# EAGLE board AMR3350 (EAGLE 9.4.1), part 1 of 2
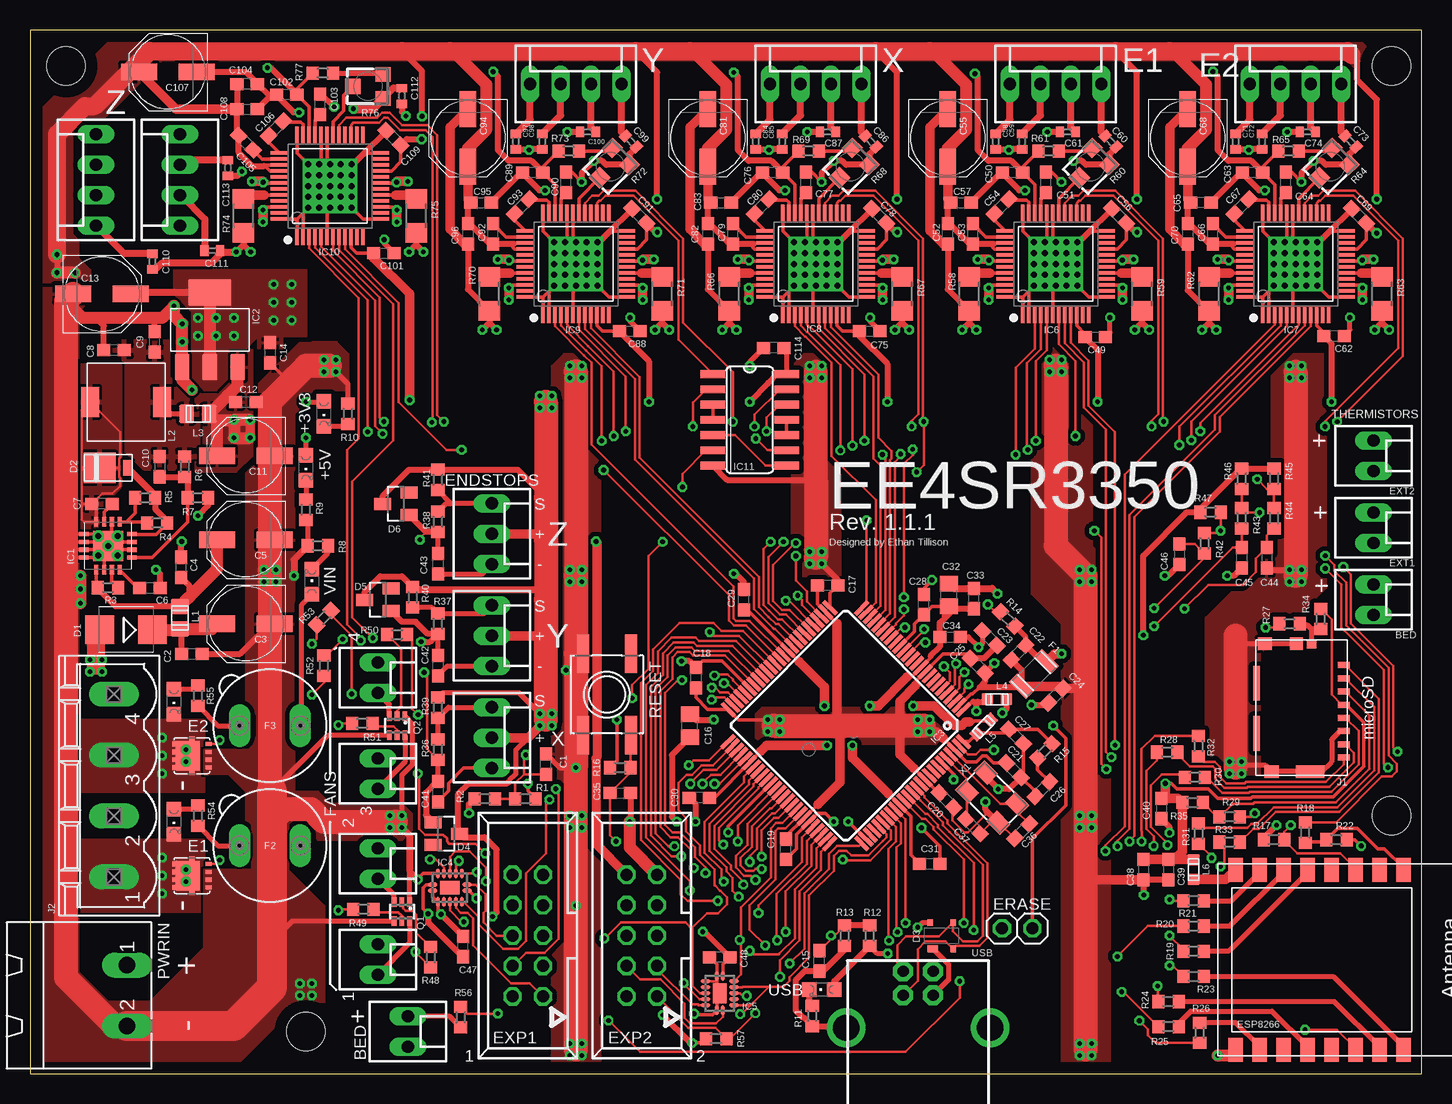
[diagram p7: board, top side]
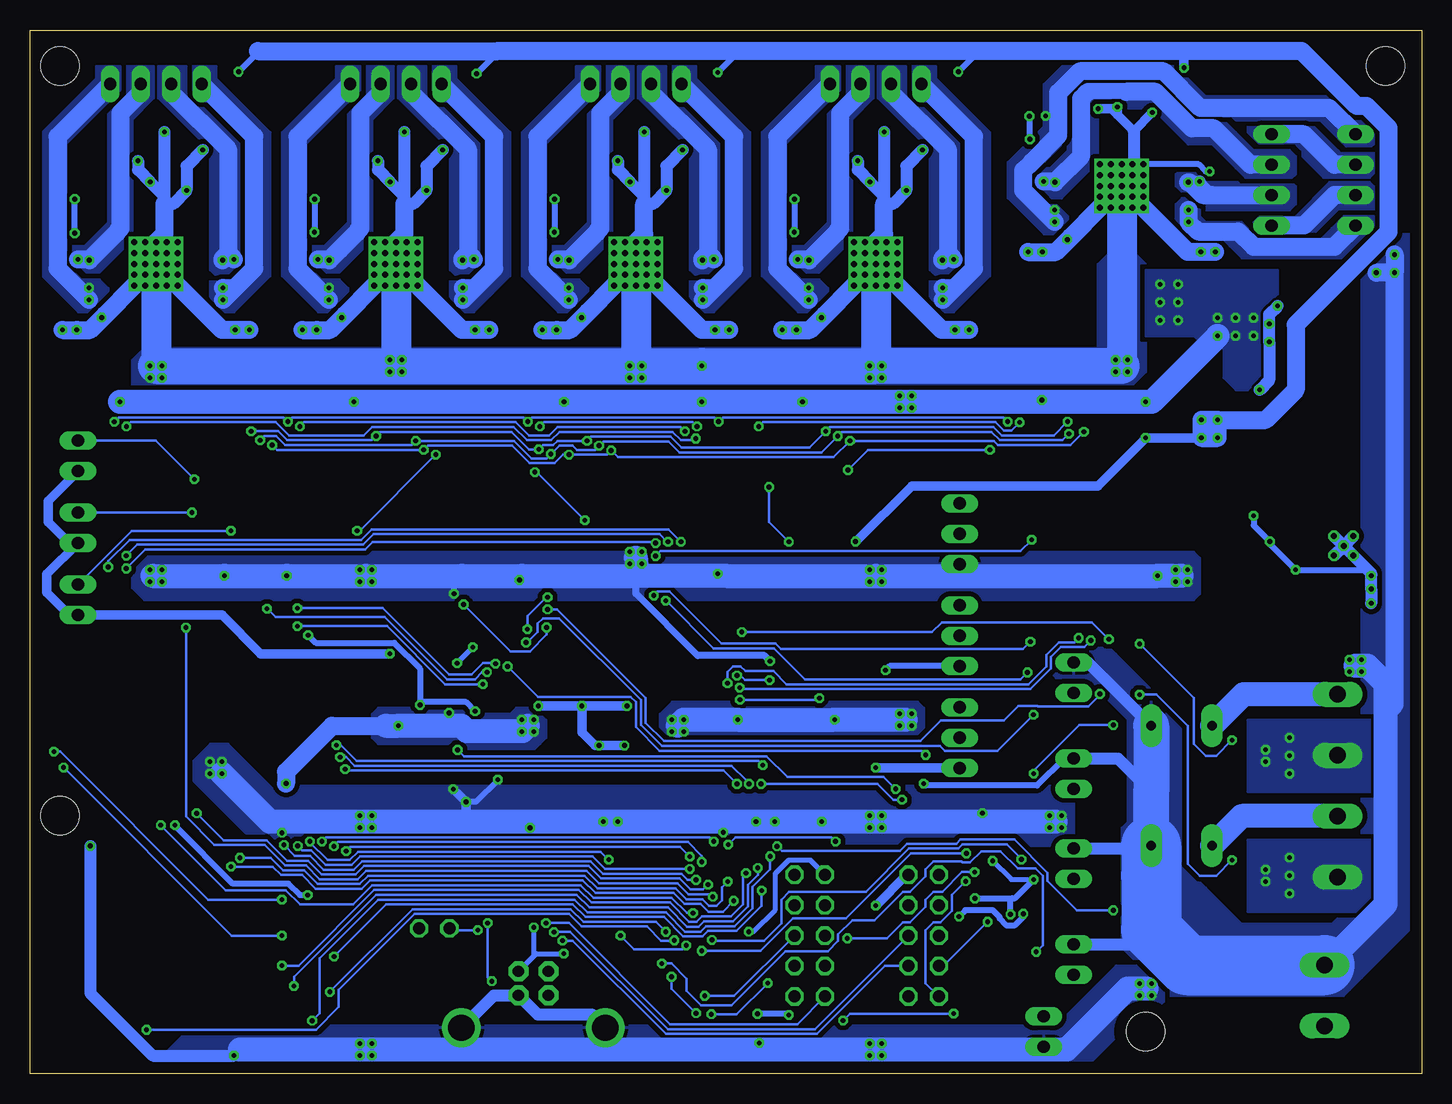
[diagram p8: board, bottom side, seen from below]

Size 116 x 87 mm. Coordinates in mm from the lower left corner, seen from the top.
Outline: 0,0 116,0 116,87 0,87 0,0
Copper layers (1*16): Top 0.035mm / dielectric 1.5mm / Bottom 0.035mm
Design rules "default *": minimum track width 0.2mm, minimum drill 0.4mm, track to track 0.2mm, track to pad 0.25mm, pad to pad 0.2mm, via to via 0.2mm, smd to smd 0.2mm, copper to edge 1mm, drill to drill 0.2mm, minimum pad ring 10mil, minimum via ring 8mil, stop-mask expansion 0mil, vias tented up to drill 16.5mil, thermal gap 10mil
Net classes: 3 usbvcc: width 0.102 mm, drill 0.1 mm, clearance 0.15 mm; 4 diff: width 0.2 mm
Holes 3.2 mm at 23,3.5 3,84 113.5,84 113.5,21.5
tKeepout: area 20,0.5 to 26,6.5; area 0,81 to 6,87; area 110.5,81 to 116.5,87; area 110.5,18.5 to 116.5,24.5

## Footprints (pad centres in the part's own frame; a part is rotated, then mirrored left to right if it is on the bottom)
CHIPLED_0805 = smd 1.2 x 1.2: A 0,-1.05; C 0,1.05
MOLEX-KK-254-2 = drill 1.02 long: 1 -1.27,0; 2 1.27,0
C0603 = smd 1.1 x 1: 1 -0.85,0; 2 0.85,0
PANASONIC_D = smd 3 x 1.4: + 2.4,0; - -2.4,0
C0805 = smd 1.3 x 1.5: 1 -0.95,0; 2 0.95,0
C0402 = smd 0.7 x 0.9: 1 -0.65,0; 2 0.65,0
SMB = smd 2.4 x 2.4: A 2.2,0; C -2.2,0
DO220AAL = smd 2.667 x 2.54: P$1 -0.7,0 | smd 0.762 x 1.27: P$2 1.65,0
SOT143B = smd 0.88 x 0.55: 1 -0.75,-1.1 | smd 0.48 x 0.55: 2 0.95,-1.1; 3 0.95,1.1; 4 -0.95,1.1
SOT23 = smd 1 x 1.4: 1 -0.95,-1.1; 2 0.95,-1.1; 3 0,1.1
1X02 = drill 1.016 octagon: 1 -1.27,0; 2 1.27,0
ESP-12 = smd 2 x 1.2: 1 -7.5,4.5; 2 -7.5,2.5; 3 -7.5,0.5; 4 -7.5,-1.5; 5 -7.5,-3.5; 6 -7.5,-5.5; 7 -7.5,-7.5; 8 -7.5,-9.5; 9 7.5,-9.5; 10 7.5,-7.5; 11 7.5,-5.5; 12 7.5,-3.5; 13 7.5,-1.5; 14 7.5,0.5; 15 7.5,2.5; 16 7.5,4.5
057-010-1 = drill 1 octagon: 1 -5.08,-1.27; 2 -5.08,1.27; 3 -2.54,-1.27; 4 -2.54,1.27; 5 0,-1.27; 6 0,1.27; 7 2.54,-1.27; 8 2.54,1.27; 9 5.08,-1.27; 10 5.08,1.27
MC36207 = smd 1 x 2: 1 -1.45,0; 2 1.45,0
19560 = drill 0.813 pad 1.778 long: 1 -2.54,0; 2 2.54,0
QFN16-4X4 = smd 0.8 x 0.35: 1 -2,0.975; 2 -2,0.325; 3 -2,-0.325; 4 -2,-0.975; 9 2,-0.975; 10 2,-0.325; 11 2,0.325; 12 2,0.975 | smd 0.35 x 0.8: 5 -0.975,-2; 6 -0.325,-2; 7 0.325,-2; 8 0.975,-2; 13 0.975,2; 14 0.325,2; 15 -0.325,2; 16 -0.975,2 | smd 2.5 x 2.5: EXP 0,0
SOT223 = smd 2.235 x 1.219: 1 -3.099,2.311; 2 -3.099,0; 3 -3.099,-2.311 | smd 2.2 x 3.6: 4 3.099,0
LQFP100 = smd 1.5 x 0.35: 1 -7.875,6; 2 -7.875,5.5; 3 -7.875,5; 4 -7.875,4.5; 5 -7.875,4; 6 -7.875,3.5; 7 -7.875,3; 8 -7.875,2.5; 9 -7.875,2; 10 -7.875,1.5; 11 -7.875,1; 12 -7.875,0.5; 13 -7.875,0; 14 -7.875,-0.5; 15 -7.875,-1; 16 -7.875,-1.5; 17 -7.875,-2; 18 -7.875,-2.5; 19 -7.875,-3; 20 -7.875,-3.5; 21 -7.875,-4; 22 -7.875,-4.5; 23 -7.875,-5; 24 -7.875,-5.5; 25 -7.875,-6; 51 7.875,-6; 52 7.875,-5.5; 53 7.875,-5; 54 7.875,-4.5; 55 7.875,-4; 56 7.875,-3.5; 57 7.875,-3; 58 7.875,-2.5; 59 7.875,-2; 60 7.875,-1.5; 61 7.875,-1; 62 7.875,-0.5; 63 7.875,0; 64 7.875,0.5; 65 7.875,1; 66 7.875,1.5; 67 7.875,2; 68 7.875,2.5; 69 7.875,3; 70 7.875,3.5; 71 7.875,4; 72 7.875,4.5; 73 7.875,5; 74 7.875,5.5; 75 7.875,6 | smd 0.35 x 1.5: 26 -6.025,-7.875; 27 -5.525,-7.875; 28 -5.025,-7.875; 29 -4.525,-7.875; 30 -4.025,-7.875; 31 -3.525,-7.875; 32 -3.025,-7.875; 33 -2.525,-7.875; 34 -2.025,-7.875; 35 -1.525,-7.875; 36 -1.025,-7.875; 37 -0.525,-7.875; 38 -0.025,-7.875; 39 0.475,-7.875; 40 0.975,-7.875; 41 1.475,-7.875; 42 1.975,-7.875; 43 2.475,-7.875; 44 2.975,-7.875; 45 3.475,-7.875; 46 3.975,-7.875; 47 4.475,-7.875; 48 4.975,-7.875; 49 5.475,-7.875; 50 5.975,-7.875; 76 6,7.875; 77 5.5,7.875; 78 5,7.875; 79 4.5,7.875; 80 4,7.875; 81 3.5,7.875; 82 3,7.875; 83 2.5,7.875; 84 2,7.875; 85 1.5,7.875; 86 1,7.875; 87 0.5,7.875; 88 0,7.875; 89 -0.5,7.875; 90 -1,7.875; 91 -1.5,7.875; 92 -2,7.875; 93 -2.5,7.875; 94 -3,7.875; 95 -3.5,7.875; 96 -4,7.875; 97 -4.5,7.875; 98 -5,7.875; 99 -5.5,7.875; 100 -6,7.875
DHVQFN14 = smd 0.8 x 0.35: 1 -1.425,-0.25; 7 1.425,-0.25; 8 1.425,0.25; 14 -1.425,0.25 | smd 0.35 x 0.8: 2 -1,-1.175; 3 -0.5,-1.175; 4 0,-1.175; 5 0.5,-1.175; 6 1,-1.175; 9 1,1.175; 10 0.5,1.175; 11 0,1.175; 12 -0.5,1.175; 13 -1,1.175 | smd 1.65 x 1.15: EXP 0,0
QFP50P900X900X113-49N_NOFID = smd 1.45 x 0.3: 1 -4.2,2.75; 2 -4.2,2.25; 3 -4.2,1.75; 4 -4.2,1.25; 5 -4.2,0.75; 6 -4.2,0.25; 7 -4.2,-0.25; 8 -4.2,-0.75; 9 -4.2,-1.25; 10 -4.2,-1.75; 11 -4.2,-2.25; 12 -4.2,-2.75; 25 4.2,-2.75; 26 4.2,-2.25; 27 4.2,-1.75; 28 4.2,-1.25; 29 4.2,-0.75; 30 4.2,-0.25; 31 4.2,0.25; 32 4.2,0.75; 33 4.2,1.25; 34 4.2,1.75; 35 4.2,2.25; 36 4.2,2.75 | smd 0.3 x 1.45: 13 -2.75,-4.2; 14 -2.25,-4.2; 15 -1.75,-4.2; 16 -1.25,-4.2; 17 -0.75,-4.2; 18 -0.25,-4.2; 19 0.25,-4.2; 20 0.75,-4.2; 21 1.25,-4.2; 22 1.75,-4.2; 23 2.25,-4.2; 24 2.75,-4.2; 37 2.75,4.2; 38 2.25,4.2; 39 1.75,4.2; 40 1.25,4.2; 41 0.75,4.2; 42 0.25,4.2; 43 -0.25,4.2; 44 -0.75,4.2; 45 -1.25,4.2; 46 -1.75,4.2; 47 -2.25,4.2; 48 -2.75,4.2 | smd 4.45 x 4.45: PAD 0,0
SO14 = smd 0.66 x 2.032: 1 -3.81,-3.073; 2 -2.54,-3.073; 3 -1.27,-3.073; 4 0,-3.073; 5 1.27,-3.073; 6 2.54,-3.073; 7 3.81,-3.073; 8 3.81,3.073; 9 2.54,3.073; 10 1.27,3.073; 11 0,3.073; 12 -1.27,3.073; 13 -2.54,3.073; 14 -3.81,3.073
MOLEX-105162 = smd 1.05 x 1.08: G1 5.325,4.45 | smd 1.05 x 1.2: G2 5.325,7.06; G3 -5.325,6.49 | smd 1.05 x 2.39: G4 -5.325,3.305 | smd 0.5 x 1: P1 3.55,0.5; P2 2.45,0.5; P3 1.35,0.5; P4 0.25,0.5; P5 -0.85,0.5; P6 -1.95,0.5; P7 -3.05,0.5; P8 -4.15,0.5 | smd 0.72 x 0.78: P9 5.31,3.18 | smd 2.91 x 0.55: X1 -2.145,7.735; X2 2.045,7.735
MSTBV4 = drill 1.397 long: 1 -7.62,0; 2 -2.54,0; 3 2.54,0; 4 7.62,0
C0805' = smd 1.5 x 1.25: 1 0,0.95; 2 0,-0.95
SRR0604 = smd 1.5 x 2.5: P$1 3,0; P$2 -3,0
C0603' = smd 1 x 0.95: 1 0,0.8; 2 0,-0.8
MOLEX-KK-254-4 = drill 1.02 long: 1 -3.81,0; 2 -1.27,0; 3 1.27,0; 4 3.81,0
MSTBA2 = drill 1.397 long: 1 -2.54,5.08; 2 2.54,5.08
SOT363_PHILIPS = smd 0.4 x 0.8: 1 -0.65,-0.8; 2 0,-0.8; 3 0.65,-0.8; 4 0.65,0.8; 5 0,0.8; 6 -0.65,0.8
3X3DFN-EP = smd 0.35 x 0.5: 1 -0.975,-1.4; 2 -0.325,-1.4; 3 0.325,-1.4; 4 0.975,-1.4 | smd 0.4 x 0.3: 5 0.975,1.5; 6 0.325,1.5; 7 -0.325,1.5; 8 -0.975,1.5 | smd 0.38 x 0.43: E1 -1.415,0; E2 1.415,0 | smd 2.45 x 1.98: PAD 0,0.36
R0603 = smd 1 x 1.1: 1 -0.85,0; 2 0.85,0
R1206 = smd 1.6 x 1.803: 1 -1.422,0; 2 1.422,0
RTRIM3103 = smd 1.2 x 1.25: 1 -1,-1.225; 3 1,-1.225 | smd 1.3 x 1.3: 2 0,1.3
EVQQ2 = smd 3.2 x 1: A -3.4,2; A' 3.4,2; B -3.4,-2; B' 3.4,-2
PN61729 = drill 0.95 pad 1.676 octagon: 1 1.25,4.71; 2 -1.25,4.71; 3 -1.25,2.71; 4 1.25,2.71 | drill 2.2: P$1 -6,0; P$2 6,0
5.0X3.2_KX-9A = smd 1.6 x 1.25: 1 -1.85,-1.1; 2 1.85,-1.1; 3 1.85,1.1; 4 -1.85,1.1
MOLEX-KK-254-3 = drill 1.02 long: 1 -2.54,0; 2 0,0; 3 2.54,0

## Placement (x,y rotation side)
+3V3  [CHIPLED_0805]  24.5,55 180 top
+5V  [CHIPLED_0805]  23,50.5 180 top
BED  KK-254-2  [MOLEX-KK-254-2]  112,39.5 270 top
BEDOUT  KK-254-2  [MOLEX-KK-254-2]  31.5,3.5 270 top
C1  10n  [C0603]  43,25.8 90 top
C2  10u  [C0603]  13.5,35 0 top
C3  100u  [PANASONIC_D]  18,37.5 180 top
C4  10u  [C0603]  12.6,42.2 90 top
C5  100u  [PANASONIC_D]  18,44.5 180 top
C6  100n  [C0603]  10,40.5 0 top
C7  22n  [C0603]  6,47.5 180 top
C8  10u  [C0603]  7,60.3 180 top
C9  10u  [C0603]  10.4,61 90 top
C10  10n  [C0603]  10.8,50.6 270 top
C11  220u  [PANASONIC_D]  18,51.5 180 top
C12  10u  [C0603]  18,56 0 top
C13  10u  [PANASONIC_D]  6,65 0 top
C14  10u  [C0603]  20,60.1 270 top
C15  100n  [C0603]  65.8,9.4 90 top
C16  10u  [C0805]  55,29 90 top
C17  100n  [C0603]  66.5,40.7 180 top
C18  100n  [C0603]  55.5,33 270 top
C19  100n  [C0603]  63,18.7 90 top
C20  100n  [C0603]  76.4,22.8 135 top
C21  100n  [C0603]  82,25.3 135 top
C22  2.2u  [C0603]  82.4,35.1 225 top
C23  100n  [C0603]  80,36.3 135 top
C24  100n  [C0603]  85.5,31.5 45 top
C25  10u  [C0603]  79,34 315 top
C26  4u7  [C0603]  84.4,23.7 225 top
C27  100n  [C0603]  82.2,28.1 315 top
C28  100n  [C0603]  74.5,39.1 90 top
C29  100n  [C0603]  59.5,39.5 90 top
C30  100n  [C0603]  55.8,23 180 top
C31  100n  [C0603]  75,17.5 0 top
C32  10u  [C0805]  76.6,39.9 90 top
C33  100n  [C0603]  78.7,39.6 90 top
C34  2.2u 0.1-10ohm ESR  [C0603]  76.7,36.4 0 top
C35  10n  [C0603]  49.2,23.4 0 top
C36  10p  [C0603]  82.7,20.2 225 top
C37  10p  [C0603]  78.6,20.6 315 top
C38  10u  [C0603]  92.8,17 270 top
C39  10u  [C0603]  94.9,17 270 top
C40  2.2u  [C0603]  94.3,22.1 270 top
C41  2.2u  [C0603]  34,23.5 270 top
C42  2.2u  [C0603]  34,34 270 top
C43  2.2u  [C0603]  34,42.5 270 top
C44  2.2u  [C0603]  103.1,43 270 top
C45  2.2u  [C0603]  101,43 270 top
C46  2.2u  [C0603]  95.8,43.3 270 top
C47  2.2u  [C0603]  36.1,10.6 90 top
C48  100n  [C0603]  57.5,9.7 180 top
C49  100n  [C0603]  88.8,61.4 0 top
C50  470n  [C0603]  81.9,75.1 180 top
C51  4u7  [C0603]  84.7,74.3 90 top
C52  100n  [C0603]  76.5,70 90 top
C53  100n  [C0603]  78.6,70 90 top
C54  22n  [C0603]  81,72.3 45 top
C55  100u  [PANASONIC_D]  76.5,78 270 top
C56  100n  [C0603]  90.8,71.5 135 top
C57  100n  [C0603]  77.6,72.6 0 top
C58  470p  [C0402]  80.5,77.7 270 top
C59  470p  [C0402]  82.7,77.7 270 top
C60  470p  [C0402]  90.1,77.7 315 top
C61  470p  [C0402]  86.5,78.5 180 top
C62  100n  [C0603]  108.7,61.5 0 top
C63  470n  [C0603]  101.9,75.1 180 top
C64  4u7  [C0603]  104.7,74.3 90 top
C65  100n  [C0603]  97.6,72.6 180 top
C66  100n  [C0603]  98.6,70 90 top
C67  22n  [C0603]  101,72.3 45 top
C68  100u  [PANASONIC_D]  96.5,78 270 top
C69  100n  [C0603]  110.8,71.5 135 top
C70  100n  [C0603]  96.5,70 270 top
C71  470p  [C0402]  100.5,77.7 270 top
C72  470p  [C0402]  102.7,77.7 270 top
C73  470p  [C0402]  110.1,77.7 315 top
C74  470p  [C0402]  106.5,78.5 180 top
C75  100n  [C0603]  70,61.9 0 top
C76  470n  [C0603]  61.9,75.1 180 top
C77  4u7  [C0603]  64.7,74.3 90 top
C78  100n  [C0603]  70.8,71.5 315 top
C79  100n  [C0603]  58.6,70 90 top
C80  22n  [C0603]  61,72.3 45 top
C81  100u  [PANASONIC_D]  56.5,78 270 top
C82  100n  [C0603]  56.5,70 270 top
C83  100n  [C0603]  57.6,72.6 0 top
C84  470p  [C0402]  60.5,77.7 270 top
C85  470p  [C0402]  62.7,77.7 270 top
C86  470p  [C0402]  70.1,77.7 315 top
C87  470p  [C0402]  66.5,78.5 180 top
C88  100n  [C0603]  50,61.9 0 top
C89  470n  [C0603]  41.9,75.1 180 top
C90  4u7  [C0603]  44.7,74.3 90 top
C91  100n  [C0603]  50.8,71.5 315 top
C92  100n  [C0603]  38.6,70 90 top
C93  22n  [C0603]  41,72.3 45 top
C94  100u  [PANASONIC_D]  36.5,78 270 top
C95  100n  [C0603]  37.6,72.6 0 top
C96  100n  [C0603]  36.5,70 270 top
C97  470p  [C0402]  40.5,77.7 270 top
C98  470p  [C0402]  42.7,77.7 270 top
C99  470p  [C0402]  50.1,77.7 315 top
C100  470p  [C0402]  46.5,78.5 180 top
C101  100n  [C0603]  29.5,68.4 0 top
C102  470n  [C0603]  21.4,81.6 180 top
C103  4u7  [C0603]  24.2,80.8 90 top
C104  100n  [C0603]  18.1,82.5 180 top
C105  100n  [C0603]  18,77.6 315 top
C106  22n  [C0603]  20.5,78.8 45 top
C107  100u  [PANASONIC_D]  11.5,83.5 180 top
C108  100n  [C0603]  18.1,80.4 0 top
C109  100n  [C0603]  30.3,78 135 top
C110  470p  [C0402]  10.2,67.7 270 top
C111  470p  [C0402]  15.2,68.6 0 top
C112  470p  [C0402]  31,81.5 90 top
C113  470p  [C0402]  16.5,75.5 270 top
C114  100n  [C0603]  62,60.5 180 top
D1  [SMB]  8,37 180 top
D2  SS1P3L  [DO220AAL]  6.5,50.5 0 top
D3  PRTR5V0U2XB  [SOT143B]  76,11.5 0 top
D4  BAT54  [SOT23]  34.7,20 270 top
D5  BAT54  [SOT23]  29,39.5 90 top
D6  BAT54  [SOT23]  30.5,47.5 90 top
ERASE  J  [1X02]  82.3,12.1 180 top
ESP8266  [ESP-12]  110,9.5 270 top
EXP1  057-010-1  [057-010-1]  41.5,11.5 90 top
EXP2  057-010-1  [057-010-1]  51,11.5 90 top
EXT1  KK-254-2  [MOLEX-KK-254-2]  112,45.5 270 top
EXT1_L  [CHIPLED_0805]  12,21 180 top
EXT2  KK-254-2  [MOLEX-KK-254-2]  112,51.5 270 top
EXT2_L  [CHIPLED_0805]  12,31 180 top
F1  MC36207  [MC36207]  83.7,33.3 225 top
F2  [19560]  20,19 180 top
F3  [19560]  20,29 180 top
FAN1  KK-254-2  [MOLEX-KK-254-2]  29,9.5 270 top
FAN2  KK-254-2  [MOLEX-KK-254-2]  29,17.5 270 top
FAN3  KK-254-2  [MOLEX-KK-254-2]  29,25 270 top
FAN4  KK-254-2  [MOLEX-KK-254-2]  29,33 270 top
IC1  A4403  [QFN16-4X4]  6.5,44 90 top
IC2  LDO-TS1117CW-3V3  [SOT223]  15,62 90 top
IC3  ATSAM4S8C  [LQFP100]  68,29 225 top
IC4  74ABT125BQ  [DHVQFN14]  35,15.5 0 top
IC5  74AHC08  [DHVQFN14]  57.5,6.7 270 top
IC6  TMC5130  [QFP50P900X900X113-49N_NOFID]  85.5,67.5 90 top
IC7  TMC5130  [QFP50P900X900X113-49N_NOFID]  105.5,67.5 90 top
IC8  TMC5130  [QFP50P900X900X113-49N_NOFID]  65.5,67.5 90 top
IC9  TMC5130  [QFP50P900X900X113-49N_NOFID]  45.5,67.5 90 top
IC10  TMC5130  [QFP50P900X900X113-49N_NOFID]  25,74 90 top
IC11  74LS32D  [SO14]  60,54.5 270 top
J1  MOLEX-105162-001  [MOLEX-105162]  110,30.5 90 top
J2  MSTBV4  [MSTBV4]  7,24 90 top
L1  MH2029-300Y  [C0805']  12.5,38 180 top
L2  10uH  [SRR0604]  8,56 180 top
L3  MPZ2012S221A  [C0805']  14,55 90 top
L4  10uH 100MHz  [C0603']  80.6,31.2 90 top
L5  10uH 100MHz  [C0603']  79.5,28.9 135 top
L6  4n7H  [C0603']  97,17 0 top
MOT-E1  KK-254-4  [MOLEX-KK-254-4]  85.5,82.5 0 top
MOT-E2  KK-254-4  [MOLEX-KK-254-4]  105.5,82.5 0 top
MOT-X  KK-254-4  [MOLEX-KK-254-4]  65.5,82.5 0 top
MOT-Y  KK-254-4  [MOLEX-KK-254-4]  45.5,82.5 0 top
MOT-Z1  KK-254-4  [MOLEX-KK-254-4]  12.5,74.5 90 top
MOT-Z2  KK-254-4  [MOLEX-KK-254-4]  5.5,74.5 90 top
PWRIN  MSTBA2  [MSTBA2]  3,6.5 270 top
Q1  NX138BKS  [SOT363_PHILIPS]  31,13.5 180 top
Q2  NX138BKS  [SOT363_PHILIPS]  30.6,29 180 top
Q3  AON7524  [3X3DFN-EP]  13.5,16.5 90 top
Q4  AON7524  [3X3DFN-EP]  13.5,26.5 90 top
R1  47K  [R0603]  41.3,22.9 0 top
R2  4.7K  [R0603]  37.9,22.9 0 top
R3  100K  [R0603]  6.5,40.5 180 top
R4  0R1  [R0603]  10.6,45.9 0 top
R5  0R1  [R0603]  9.6,48 0 top
R6  3K92  [R0603]  12.9,50.6 90 top
R7  750R  [R0603]  14,48 180 top
R8  4K7  [R0603]  24,44 180 top
R9  2K2  [R0603]  23,47 270 top
R10  180R  [R0603]  26.5,55 90 top
R11  2K2  [R0603]  65.2,4.8 270 top
R12  27K  [R0603]  70,11.5 90 top
R13  47K  [R0603]  67.9,11.5 270 top
R14  10K  [R0603]  81.5,37.9 315 top
R15  1R  [R0603]  84.6,26.9 45 top
R16  10K  [R0603]  49.2,25.5 180 top
R17  4K7  [R0603]  103.7,19.5 180 top
R18  470R  [R0603]  106.3,20.1 270 top
R19  47R  [R0603]  97,10.2 180 top
R20  47R  [R0603]  97,12.3 180 top
R21  47R  [R0603]  97,14.4 180 top
R22  2K2  [R0603]  108.9,19.5 180 top
R23  2K2  [R0603]  97,8.1 0 top
R24  470R  [R0603]  94.9,6 0 top
R25  2K2  [R0603]  94.9,3.9 0 top
R26  2K2  [R0603]  97.5,3.4 90 top
R27  220R  [R0603]  105,37.5 0 top
R28  220R  [R0603]  94.8,26.8 0 top
R29  220R  [R0603]  100,21.4 180 top
R30  100R  [R0603]  97.1,24.7 0 top
R31  220R  [R0603]  97.4,20 90 top
R32  220R  [R0603]  97.4,27.3 270 top
R33  220R  [R0603]  100,19.3 0 top
R34  10K  [R0603]  107.6,37.9 90 top
R35  10K  [R0603]  96.9,22.6 180 top
R36  10K  [R0603]  34,27 90 top
R37  10K  [R0603]  34,37.5 90 top
R38  10K  [R0603]  34,46 90 top
R39  10K  [R0603]  34,30.5 90 top
R40  10K  [R0603]  31.9,39.7 90 top
R41  10K  [R0603]  34,49.5 90 top
R42  10K  [R0603]  97.9,44.2 90 top
R43  10K  [R0603]  101,46.3 90 top
R44  10K  [R0603]  103.7,46.3 90 top
R45  4K7 0.1%  [R0603]  103.7,49.6 90 top
R46  4K7 0.1%  [R0603]  101,49.6 90 top
R47  4K7 0.1%  [R0603]  98.4,46.8 180 top
R48  1K  [R0603]  33.4,9.7 90 top
R49  1K  [R0603]  27.8,13.7 0 top
R50  1K  [R0603]  30.6,36.6 180 top
R51  1K  [R0603]  27.7,29.2 0 top
R52  180R  [R0603]  24.5,34 270 top
R53  180R  [R0603]  24.5,38 225 top
R54  4K7  [R0603]  14,21.5 270 top
R55  4K7  [R0603]  14,31.5 270 top
R56  180R  [R0603]  35.9,4.7 270 top
R57  4K7  [R0603]  57.2,2.9 0 top
R58  0R11  [R1206]  78.3,65 270 top
R59  0R11  [R1206]  92.7,65 270 top
R60  20K  [RTRIM3103]  88.4,75.6 135 top
R61  20K  [R0603]  84.9,76.9 180 top
R62  0R11  [R1206]  98.3,65 270 top
R63  0R11  [R1206]  112.7,65 270 top
R64  20K  [RTRIM3103]  108.4,75.6 135 top
R65  20K  [R0603]  104.9,76.9 180 top
R66  0R11  [R1206]  58.3,65 270 top
R67  0R11  [R1206]  72.7,65 270 top
R68  20K  [RTRIM3103]  68.4,75.6 135 top
R69  20K  [R0603]  64.9,76.9 180 top
R70  0R11  [R1206]  38.3,65 270 top
R71  0R11  [R1206]  52.7,65 270 top
R72  20K  [RTRIM3103]  48.4,75.6 135 top
R73  20K  [R0603]  44.9,76.9 180 top
R74  0R11  [R1206]  17.8,71.5 270 top
R75  0R11  [R1206]  32.2,71.5 270 top
R76  20K  [RTRIM3103]  28.2,82.3 90 top
R77  20K  [R0603]  24.4,83.4 180 top
RESET  [EVQQ2]  48.1,31.6 270 top
USB  USB-B_TH  [PN61729]  74.03,3.81 0 top
USB_L  [CHIPLED_0805]  66,7 90 top
VIN  [CHIPLED_0805]  23.5,41 0 top
X1  12MHz  [5.0X3.2_KX-9A]  80.2,23 315 top
X_STOP  KK-254-3  [MOLEX-KK-254-3]  38.5,28 270 top
Y_STOP  KK-254-3  [MOLEX-KK-254-3]  38.5,36.5 270 top
Z_STOP  KK-254-3  [MOLEX-KK-254-3]  38.5,45 270 top

## Tracks (layer width: path | path; a pad name or v marks a point on that pad's centre or on a via)
3V3_LED
  Top 0.4: R10.1 26.3,53.95 +3V3.C
5V_E1
  Top 0.3: IC6.33 84.25,73 C51.1
5V_E2
  Top 0.3: IC7.33 104.25,73 C64.1
5V_LED
  Top 0.4: +5V.C R9.1
5V_X
  Top 0.3: IC8.33 64.25,73 C77.1
5V_Y
  Top 0.3: IC9.33 44.25,73 C90.1
5V_Z
  Top 0.3: IC10.33 23.75,79.5 C103.1
12V_LED
  Top 0.4: VIN.C 24.85,43.4 R8.1
+3V3  (via drill 0.4, 0.4 pad 0.55)
  Top 0.2: v42.5,56.5 43,56 | v43.5,56.5 43,56 | v43.5,55.5 43,56 | v42.5,55.5 43,56 | v62.5,29.5 62,29 | v62.5,28.5 62,29 | v61.5,28.5 62,29 | v75,29.5 74.5,29 | v74,29.5 74.5,29 | v74,28.5 74.5,29 | v75,28.5 74.5,29 | J1.P4 109.36,30.75 108.5,31.61 108.5,37.85 R34.2
  Top 0.21: v43.5,30 43,29.5 | v42.5,30 43,29.5 | v43.5,29 43,29.5 | v42.5,29 43,29.5
  Top 0.3: C49.1 87.95,61.66 87.25,62.36 IC6.10 | C62.1 107.85,61.76 107.25,62.36 IC7.10 | C75.1 67.71,61.9 67.25,62.36 IC8.10 | C88.1 47.71,61.9 47.25,62.36 IC9.10 | C101.1 27.21,68.4 26.75,68.86 IC10.10 | C25.1 78,35 76.12,35 IC3.10 73.82,32.7 73.82,32.34 | C19.2 63,19.76 IC3.69 65.69,22.45 | C20.2 75.72,23.4 IC3.91 73.68,25.44 | J1.P4 109.72,30.75 111.2,29.27 111.2,25.6 108.65,23.05 101.88,23.05 101.78,22.95 99.02,22.95 98.22,23.75 95.58,23.75 95.16,24.17 v94.65,24.17 | v61.5,29.5 59.05,29.5 IC3.50 58.19,30.36 56.49,30.36 55.5,31.35 C18.2 | 67.29,37.52 IC3.27 65.65,39.16 C17.2 | 76.15,27.92 IC3.98 78.07,26 78.89,26 79.38,26.49 79.71,26.49 80.3,25.9 C21.2 | IC4.14 33.54,15.71 33,15.71 32.77,15.49 32.77,13.74 v33.2,13.32 | ERASE.1 83.57,19.6 86.34,22.37 86.34,27.96 v85.3,29 | R16.2 48.93,26.08 v48.93,29.49 v48.92,29.5
  Top 0.4: C114.1 63.07,60.28 IC11.14 | v23,56 24.45,56 +3V3.A | R39.2 34.41,31.75 40.74,31.75 v42.5,30 | 41.5,28 40.48,26.98 40.48,24.96 39.95,24.43 39.95,24.36 39.9,24.31
  Top 0.5: C75.1 69.15,61.5 71.47,59.18 v71.47,56 | v60,56 61.56,57.56 61.56,57.58 62.29,58.31 IC11.14 | C88.1 49.15,61.84 51.6,59.4 v51.6,56 | L4.2 81.4,30.4 v81.06,30.06 | D6.3 29.4,48.16 31.59,50.35 R41.2 40.65,50.35 43,48 | D5.3 27.9,40.16 29.19,41.45 31.01,41.45 R40.2 | C16.2 55.45,29.5 v57,29.5 | v38.55,13.09 38.91,13.45 38.91,18.67 37.88,19.7 36.1,19.7 D4.3 35.7,20.1 35.7,23.31 36.59,24.2 39.79,24.2 39.9,24.31 | v33.2,13.32 33.2,12.6 36.04,9.75 C47.1 | v108.5,56 108.5,60.85 C62.1 | v89,56 89,60.29 87.95,61.34 C49.1 | C23.1 79.54,34.64 78.44,34.64 C25.1
  Top 0.6: IC2.4 8.5,65.1 C13.+ | R40.2 32.09,40.35 42.15,40.35 43,39.5
  Top 0.8: C101.1 28.65,68 31.64,65.01 v31.64,56.14 | C38.1 C39.1 | C39.1 96.95,17.85 L6.1 | Z_STOP.2 42.5,45 43,44.5 | Y_STOP.2 42.5,36.5 43,36 | X_STOP.2 41.5,28 43,29.5 | v61.5,29.5 62,29 | 67.29,37.52 67.29,29.21 67.5,29 67.5,24.26 65.69,22.45 | 73.82,32.34 72.5,31.02 72.5,29 72.5,26.62 73.68,25.44 | v75,28.5 75.57,28.5 76.15,27.92 | v94.65,24.17 v94.66,24.18 94.66,23.31 C40.1 95.7,22.95 R35.2 96.05,18.5 95.4,17.85 C39.1
  Top 1: IC2.2 IC2.4
  Top 2: 43,56 43,48 43,44.5 43,39.5 43,36 43,29.5 | 62,29 67.5,29 72.5,29 74.5,29
  Bottom 0.2: v42.5,56.5 43,56 | v43.5,56.5 43,56 | v43.5,55.5 43,56 | v42.5,55.5 43,56 | v62.5,28.5 v62.5,29.5 v61.5,29.5 | v62.5,28.5 v61.5,28.5 v61.5,29.5 | 74.95,28.55 75,28.59 v75,29.5 v74,29.5 v74,28.5 v75,28.5 | v61.5,29.5 v62.5,28.5
  Bottom 0.21: v42.5,30 43,29.5 | v43.5,30 43,29.5 | v43.5,29 43,29.5 | v42.5,29 43,29.5
  Bottom 0.3: 49,29.5 v48.92,29.5
  Bottom 0.5: 80.04,29 81.06,30.02 v81.06,30.06 | v38.55,13.09 38.04,13.61 35.74,13.61 35.17,13.03 35.17,12.9 34.64,12.37 33.89,12.37 33.2,13.06 v33.2,13.32
  Bottom 0.8: v31.64,56.14 32.66,56.14 32.8,56
  Bottom 1.5: 86.32,29 90.82,29 94.66,25.16 v94.66,24.18
  Bottom 2: v17,61.5 22.5,56 v23,56 32.8,56 43,56 v51.6,56 v60,56 v71.47,56 v89,56 v108.5,56 | 43,29.5 v48.92,29.5 | 49,29.5 v57,29.5 v61.5,29.5 61.99,29.01 | 74.5,29 74.95,28.55 79.58,28.55 80.04,29 v85.3,29 86.32,29
  other vias: 14,61.5 15.5,61.5 14,63 15.5,63 17,63 20.3,65.8 21.8,65.8 21.8,64.3 21.8,62.8 20.3,62.8 20.3,64.3
  pour Top (isolate 0.2, rank 2, no thermals): 14.5,57 13.5,58 13.5,63.5 12,65 12,67 23,67 23,61.5 19,61.5 18,60.5 16.5,60.5 16.5,58 15.5,57
  pour Bottom (isolate 0.2, no thermals): 14.5,57 13.5,58 13.5,63.5 12,65 12,67 23,67 23,61.5 19,61.5 18,60.5 16.5,60.5 16.5,58 15.5,57
  pour Top (isolate 0.2): 19,62.5 19,60.5 21,60.5 21,62.5
  pour Bottom (isolate 0.4, rank 6): 41.5,30 41.5,30.5 42,31 62.5,31 63.5,30 63.5,29.5 63.5,28 63,27.5 61,27.5 60.5,28 42,28 41.5,28.5
  pour Bottom (isolate 0.4, rank 6): 73,29.5 74,30.5 75.5,30.5 76,30 79,30 79.5,30.5 87,30.5 87.5,30 87.5,28 87,27.5 81,27.5 80.5,27.5 80,27 74,27 73.5,27.5 73,28
  pour Top (isolate 0.4, rank 6): 61,30.5 60.5,30 60.5,28.5 60.5,28 61,27.5 75.5,27.5 76,28 76,30 75.5,30.5
+5V  (via drill 0.4, 0.4 pad 0.55)
  Top 0.3: IC6.34 83.75,74.1 C50.1 82.75,75.6 R61.2 | IC7.34 103.75,74.1 C63.1 102.75,75.6 R65.2 | IC8.34 63.75,74.1 C76.1 62.75,75.6 R69.2 | IC9.34 43.75,74.1 C89.1 42.75,75.6 R73.2 | IC10.34 23.25,80.6 C102.1 22.25,82.1 R77.2 | IC5.14 57.75,9.1 C48.1
  Top 0.4: +5V.A v23,53 | C48.1 57.66,10.39 57.65,10.39 56.21,11.82 v56.09,11.82
  Top 0.5: C12.1 17,56 16.48,56.52 | C50.1 82.75,75.16 81.81,76.1 79.9,76.1 79,77 79,83.13 v78.77,83.36 | C63.1 102.75,75.16 101.81,76.1 99.9,76.1 99,77 99,83.13 v98.61,83.52 | C76.1 62.75,75.16 61.81,76.1 59.9,76.1 59,77 59,83.13 v58.66,83.47 | C89.1 42.75,75.16 41.81,76.1 39.9,76.1 39,77 39,83.13 v38.62,83.52 | C102.1 22.25,81.66 20.06,83.85 v19.79,83.85 | 15.6,54.35 15.75,54.5 v17,54.5
  Top 0.75: 47.25,28.5 47.25,26.33 47.17,26.26 47.17,19.14 EXP2.10
  Top 0.8: v47.18,44.35 47.25,44.28 47.25,28.5 | 18.3,54.5 18.35,54.45 v18.35,53 18.3,53
  Top 1: L3.2 15.6,54.35 C11.+ | L3.2 16.48,56.52 17.31,57.36 IC2.3 | L3.2 15.45,54.5 v17,54.5 | 18.3,54.5 v17,54.5 | v17,54.5 v17,53 18.3,53
  Bottom 0.4: EXP2.10 50.93,17.78 52.77,17.78 53.87,16.68 53.87,13.66 55.71,11.82 v56.09,11.82
  Bottom 0.5: 77,85.25 77,85.13 v78.77,83.36 | 97,85.25 97,85.13 v98.61,83.52 | v38.62,83.52 37,85.13 37,85.25 | 55.7,85.25 56.88,85.25 v58.66,83.47
  Bottom 0.8: v19.79,83.85 19.79,84.96 19.5,85.25 | v18.35,53 v23,53 27,49 42.5,49 47.15,44.35 v47.18,44.35
  Bottom 1.5: v17,54.5 v18.35,54.5 v18.35,53 v17,53 v17,54.5 | v17,54.5 13,54.5 10.5,57 10.5,62.43 2.75,70.18 2.75,78.82 4.58,80.65 5.39,80.65 9.99,85.25 19.5,85.25 37,85.25 55.7,85.25 77,85.25 97,85.25
  pour Top (rank 4): 13.8,50.2 13.8,57 15.9,57 16.3,57.4 16.3,60 16.6,60.3 18.5,60.3 18.5,51.5 17.2,50.2
+12V  (via drill 0.4, 0.4 pad 0.55)
  Top 0.2: v6,33.5 5.5,34 | v6,34.5 5.5,34 | v5,34.5 5.5,34 | v5,33.5 5.5,34
  Top 0.3: C56.1 91.4,69.51 90.64,68.75 IC6.21 | IC6.39 80.42,69.25 80.32,69.15 | IC6.40 80.4,68.75 80,69.15 | C69.1 111.4,69.51 110.64,68.75 IC7.21 | IC7.39 100.42,69.25 100.32,69.15 | IC7.40 100.4,68.75 100,69.15 | C78.2 71.4,69.51 70.64,68.75 IC8.21 | IC8.40 60.4,68.75 60,69.15 | C91.2 51.4,69.51 50.64,68.75 IC9.21 | IC9.39 40.42,69.25 40.32,69.15 | IC9.40 40.4,68.75 40,69.15 | C109.1 30.9,76.01 30.14,75.25 IC10.21 | IC10.39 19.5,75.75 19.6,75.65 | IC10.40 20,75.25 19.6,75.65 | 19.5,75.65 19.6,75.65 | R1.2 41.5,23.55 v41.5,24.17 | IC8.39 60.42,69.25 60.32,69.15
  Top 0.4: VIN.A 22.65,39.1 22.65,29.11 F3.1
  Top 0.5: 80.32,69.15 80,69.15 C53.1 78.36,69.15 76.66,70.85 C52.2 76.5,72.35 C57.1 | 100.32,69.15 100,69.15 C66.1 98.36,69.15 96.66,70.85 C70.1 96.5,72.35 C65.2 | 60.32,69.15 60,69.15 C79.1 58.36,69.15 56.66,70.85 C82.1 56.5,72.35 C83.1 | 40.32,69.15 40,69.15 C92.1 38.36,69.15 36.66,70.85 C96.1 36.5,72.35 C95.1 | C104.2 C108.1 17.25,78.35 C105.1 17.36,78.16 17.36,76.83 18.54,75.65 19.5,75.65 | v92.27,72.9 92.27,83.48 90.5,85.25 | v52.27,72.9 52.27,83.48 50.5,85.25 | v72.27,72.9 72.27,83.48 70.5,85.25 | v112.27,72.9 112.27,81.2 110.65,82.82 110.65,84.42 110.15,84.92 | C69.1 112.23,70.07 v112.27,70.07 | v92.3,70.14 92.16,70.14 C56.1 | v72.3,70.14 72.16,70.14 C78.2 | v52.3,70.14 52.16,70.14 C91.2 | v32.64,77.9 31.41,77.9 C109.1 | v32.69,79.81 32.69,83.56 31,85.25 | v2.25,68.28 v2.25,66.76
  Top 0.8: C55.+ 76.5,72.85 C57.1 | C68.+ 96.5,72.85 C65.2 | C81.+ 56.5,72.85 C83.1 | C94.+ 36.5,72.85 C95.1 | C107.+ 12.2,80.4 C108.1
  Top 1: v3.76,66.76 v2.25,66.76 | C55.+ 76.5,77.14 78.05,78.69 78.05,82.45 75.25,85.25 75,85.25 | C94.+ 36.5,77.14 38.05,78.69 38.05,82.45 35.25,85.25 35,85.25 | C81.+ 56.5,77.14 58.05,78.69 58.05,82.45 55.25,85.25 55,85.25 | C68.+ 96.5,77.14 98.05,78.69 98.05,82.45 95.25,85.25 95,85.25
  Top 1.5: 5.5,34 5.5,36.7 D1.A | 110.15,84.92 109.82,85.25 95,85.25 90.5,85.25 75,85.25 70.5,85.25 55,85.25 50.5,85.25 35,85.25 31,85.25 9.99,85.25 5.39,80.65 4.58,80.65 2.25,78.32 v2.25,68.28
  Bottom 0.2: v5,34.5 4.5,34 v5,33.5 | v5,34.5 v6,34.5 | v5,34.5 5.5,34 v6,33.5
  Bottom 0.5: FAN3.1 29.78,26.27 32.05,24 41.33,24 v41.5,24.17 | v112.27,70.07 v112.27,72.9 | v92.3,70.14 92.27,70.17 v92.27,72.9 | v72.3,70.14 72.27,70.17 v72.27,72.9 | v52.3,70.14 52.27,70.17 v52.27,72.9 | v32.64,77.9 32.64,79.76 v32.69,79.81
  Bottom 1: FAN1.1 23.77,10.77 22.54,12 | FAN2.1 24.81,18.77 22.54,16.5 | FAN3.1 25.31,26.27 22.54,23.5 | FAN4.1 27.81,34.27 F3.1
  Bottom 1.5: 3,30 2.25,30.75 v2.25,66.76 | v2.25,68.28 v2.25,66.76 | v2.25,66.76 v3.76,66.76
  Bottom 2: PWRIN.1 3,14.12 3,30 3,32.5 4.5,34 5.5,34
  Bottom 3: F3.1 22.54,23.5 F2.1
  Bottom 5: PWRIN.1 19.58,9.04 22.54,12 22.54,16.5 F2.1
  pour Bottom (isolate 0.4, rank 6): 9,7 6,7 1,12 1,70 3,70 5,68 5,15 10,10 10,8
  pour Top (isolate 0.4, rank 6): 1,66 5,66 5,67 4,68 4,69.5 3.5,70 3.5,78 5,79.5 6,79.5 11,84.5 109.5,84.5 110,84 111.5,84 111.5,85.5 110,87 7.5,87 1,80.5
  pour Bottom (isolate 0.4, rank 6): 5,8 5,10 7.5,12.5 9.5,12.5 15,12.5 18,15.5 19.5,17 19.5,22 19.5,29 25.5,35 26,35.5 30,35.5 30.5,35.5 31,35 31,33.5 30.5,33 28,33 27,32 24.5,29.5 24.5,25 24.5,21 25,20.5 25,10.5 23,8.5 21,6.5 6.5,6.5
A1_E1  (via drill 0.4)
  Top 0.3: IC6.46 80.17,65.75 v79.92,65.5
  Top 0.6: C58.1 81.69,79.54 MOT-E1.1
  Top 0.8: v79.92,65.5 v79.92,64.5
  Bottom 1.5: v79.92,64.5 78.92,65.5 | 78.92,65.5 77.3,67.12 77.3,78.11 MOT-E1.1 | v79.92,65.5 78.92,65.5
  pour Bottom (isolate 0.4, rank 5, no thermals): 79,63.5 80.5,63.5 81,64 81,66.5 79.5,66.5 78,68 78,77.5 82.5,82 82.5,84 80.5,84 80.5,83 76,78.5 76,66.5
A1_E2  (via drill 0.4)
  Top 0.3: IC7.46 100.17,65.75 v99.92,65.5
  Top 0.6: C71.1 101.69,79.54 MOT-E2.1
  Top 0.8: v99.92,65.5 v99.92,64.5
  Bottom 1.5: v99.92,64.5 98.92,65.5 | 98.92,65.5 97.3,67.12 97.3,78.11 MOT-E2.1 | v99.92,65.5 98.92,65.5
  pour Bottom (isolate 0.4, rank 5, no thermals): 99,63.5 100.5,63.5 101,64 101,66.5 99.5,66.5 98,68 98,77.5 102.5,82 102.5,84 100.5,84 100.5,83 96,78.5 96,66.5
A1_X  (via drill 0.4)
  Top 0.3: IC8.46 60.17,65.75 v59.92,65.5
  Top 0.6: C84.1 61.69,79.54 MOT-X.1
  Top 0.8: v59.92,65.5 v59.92,64.5
  Bottom 1.5: v59.92,64.5 58.92,65.5 | 58.92,65.5 57.3,67.12 57.3,78.11 MOT-X.1 | v59.92,65.5 58.92,65.5
  pour Bottom (isolate 0.4, rank 5, no thermals): 59,63.5 60.5,63.5 61,64 61,66.5 59.5,66.5 58,68 58,77.5 62.5,82 62.5,84 60.5,84 60.5,83 56,78.5 56,66.5
A1_Y  (via drill 0.4)
  Top 0.3: IC9.46 40.17,65.75 v39.92,65.5
  Top 0.6: C97.1 41.69,79.54 MOT-Y.1
  Top 0.8: v39.92,65.5 v39.92,64.5
  Bottom 1.5: v39.92,64.5 38.92,65.5 | 38.92,65.5 37.3,67.12 37.3,78.11 MOT-Y.1 | v39.92,65.5 38.92,65.5
  pour Bottom (isolate 0.4, rank 5, no thermals): 39,63.5 40.5,63.5 41,64 41,66.5 39.5,66.5 38,68 38,77.5 42.5,82 42.5,84 40.5,84 40.5,83 36,78.5 36,66.5
A1_Z  (via drill 0.4)
  Top 0.3: IC10.46 19.67,72.25 v19.42,72
  Top 0.6: C110.1 7.84,68.35 MOT-Z2.1
  Top 0.8: v19.42,72 v19.42,71
  Bottom 1.5: MOT-Z2.1 7.26,68.92 14,68.92 15.27,70.2 18.62,70.2 v19.42,71 v19.42,72
  pour Bottom (isolate 0.4, rank 4, no thermals): 19,73 18.5,72.5 18.5,71.5 18,71 15.5,71 15,71 13.5,69.5 8.5,69.5 7.5,70.5 6.5,71.5 4.5,71.5 4,71.5 3.5,71 3.5,70 5.5,68 9,68 15,68 16,69 16.5,69.5 18,69.5 19,69.5 19.5,70 20.5,71 20.5,72 20.5,72.5 20,73
A2_E1  (via drill 0.4)
  Top 0.3: IC6.42 80,67.75 v79.95,67.8
  Top 0.6: C59.1 84.23,79.88 MOT-E1.2
  Top 0.8: v79.95,67.8 79.88,67.88 v79,67.88
  Bottom 1.5: v79,67.88 79.5,68.38 | MOT-E1.2 84.23,81.78 79.5,77.05 79.5,68.38 | v79.95,67.8 79.95,67.93 79.5,68.38
  pour Bottom (isolate 0.4, rank 4, no thermals): 81,77 81,67 80.5,66.5 79,66.5 78,67.5 78,77 83,82 83,84 85.3,84 85.3,81.3
A2_E2  (via drill 0.4)
  Top 0.3: IC7.42 100,67.75 v99.95,67.8
  Top 0.6: C72.1 104.23,79.88 MOT-E2.2
  Top 0.8: v99.95,67.8 99.88,67.88 v99,67.88
  Bottom 1.5: v99,67.88 99.5,68.38 | MOT-E2.2 104.23,81.78 99.5,77.05 99.5,68.38 | v99.95,67.8 99.95,67.93 99.5,68.38
  pour Bottom (isolate 0.4, rank 4, no thermals): 101,77 101,67 100.5,66.5 99,66.5 98,67.5 98,77 103,82 103,84 105.3,84 105.3,81.3
A2_X  (via drill 0.4)
  Top 0.3: IC8.42 60,67.75 v59.95,67.8
  Top 0.6: C85.1 64.23,79.88 MOT-X.2
  Top 0.8: v59.95,67.8 59.88,67.88 v59,67.88
  Bottom 1.5: v59,67.88 59.5,68.38 | MOT-X.2 64.23,81.78 59.5,77.05 59.5,68.38 | v59.95,67.8 59.95,67.93 59.5,68.38
  pour Bottom (isolate 0.4, rank 4, no thermals): 61,77 61,67 60.5,66.5 59,66.5 58,67.5 58,77 63,82 63,84 65.3,84 65.3,81.3
A2_Y  (via drill 0.4)
  Top 0.3: IC9.42 40,67.75 v39.95,67.8
  Top 0.6: C98.1 44.23,79.88 MOT-Y.2
  Top 0.8: v39.95,67.8 39.88,67.88 v39,67.88
  Bottom 1.5: v39,67.88 39.5,68.38 | MOT-Y.2 44.23,81.78 39.5,77.05 39.5,68.38 | v39.95,67.8 39.95,67.93 39.5,68.38
  pour Bottom (isolate 0.4, rank 4, no thermals): 41,77 41,67 40.5,66.5 39,66.5 38,67.5 38,77 43,82 43,84 45.3,84 45.3,81.3
A2_Z  (via drill 0.4)
  Top 0.3: IC10.42 19.5,74.25 v19.45,74.3
  Top 0.6: MOT-Z1.2 12.59,73.23 14.58,71.23 14.58,68.63 C111.1
  Top 0.8: v19.45,74.3 19.38,74.38 v18.5,74.38
  Bottom 1: v18.5,74.38 18.5,74.23 17.5,73.23
  Bottom 1.5: v19.45,74.3 19.32,74.3 18.25,73.23 17.5,73.23 MOT-Z1.2
  pour Bottom (isolate 0.4, rank 5, no thermals): 10.5,74 10.5,72.5 11,72 18.5,72 20,73.5 20.5,74 20.5,75 20,75.5 19.5,75.5 18.5,75.5 17.5,74.5 17.3,74.3 10.8,74.3
A_Z
  Bottom 1.5: MOT-Z2.2 7.27,73.23 9.81,70.69 MOT-Z1.1
  pour Bottom (isolate 0.4, rank 6, no thermals): 4,74 3.5,73.5 3.5,72.5 4,72 6.5,72 7,72 9,70 13.5,70 14,70.5 14,71 13.5,71.5 10.5,71.5 7.7,74.3 6.9,74.3 4.3,74.3
ADVREF  (via drill 0.4)
  Top 0.3: IC3.1 78.48,31 78.63,31
  Top 0.5: 78.63,31 79,31 | 79,31 79.6,31 L4.1 | v78.9,30.2 78.9,30.9 79,31 | v83.49,30.72 84.72,30.72 C24.1 | R45.2 R46.2 100.94,50.45 97.55,47.06 R47.2 96.44,46.8 92.81,43.17 v92.81,36.54
  Bottom 0.5: v78.9,30.2 79.67,30.97 83.25,30.97 v83.49,30.72 83.49,33.77 85.63,35.9 92.17,35.9 v92.81,36.54
B1_E1  (via drill 0.4)
  Top 0.3: IC6.15 90.83,65.75 v91.08,65.5
  Top 0.6: C60.1 89.31,78.49 MOT-E1.4
  Top 0.8: v91.08,64.5 v91.08,65.5
  Bottom 1.5: v91.08,64.5 93.7,67.12 93.7,78.11 MOT-E1.4
  pour Bottom (isolate 0.4, rank 3, no thermals): 90.2,66.2 91.7,66.2 93,67.5 93,77.5 88.5,82 88.5,84 90.5,84 90.5,83 95,78.5 95,66.5 92,63.5 90.5,63.5 89.5,64.5 89.5,65.5
B1_E2  (via drill 0.4)
  Top 0.3: IC7.15 110.83,65.75 v111.08,65.5
  Top 0.6: C73.1 109.31,78.49 MOT-E2.4
  Top 0.8: v111.08,64.5 v111.08,65.5
  Bottom 1.5: v111.08,64.5 113.7,67.12 113.7,78.11 MOT-E2.4
  pour Bottom (isolate 0.4, rank 3, no thermals): 110.2,66.2 111.7,66.2 113,67.5 113,77.5 108.5,82 108.5,84 110.5,84 110.5,83 115,78.5 115,66.5 112,63.5 110.5,63.5 109.5,64.5 109.5,65.5
B1_X  (via drill 0.4)
  Top 0.3: IC8.15 70.83,65.75 v71.08,65.5
  Top 0.6: C86.1 69.31,78.49 MOT-X.4
  Top 0.8: v71.08,64.5 v71.08,65.5
  Bottom 1.5: v71.08,64.5 73.7,67.12 73.7,78.11 MOT-X.4
  pour Bottom (isolate 0.4, rank 3, no thermals): 70.2,66.2 71.7,66.2 73,67.5 73,77.5 68.5,82 68.5,84 70.5,84 70.5,83 75,78.5 75,66.5 72,63.5 70.5,63.5 69.5,64.5 69.5,65.5
B1_Y  (via drill 0.4)
  Top 0.3: IC9.15 50.83,65.75 v51.08,65.5
  Top 0.6: C99.1 49.31,78.49 MOT-Y.4
  Top 0.8: v51.08,64.5 v51.08,65.5
  Bottom 1.5: v51.08,64.5 53.7,67.12 53.7,78.11 MOT-Y.4
  pour Bottom (isolate 0.4, rank 3, no thermals): 50.2,66.2 51.7,66.2 53,67.5 53,77.5 48.5,82 48.5,84 50.5,84 50.5,83 55,78.5 55,66.5 52,63.5 50.5,63.5 49.5,64.5 49.5,65.5
B1_Z  (via drill 0.4)
  Top 0.3: IC10.15 30.33,72.25 v30.58,72
  Top 0.5: C112.1 31,80.17 v31.33,79.83
  Top 0.8: v30.58,71 v30.58,72
  Bottom 0.5: v31.33,79.83 30.94,79.83 30.27,80.5
  Bottom 1.5: v30.58,71 33.2,73.62 33.2,75.3 32.5,76 30.27,78.22 30.27,80.5 30.27,81.78 28.5,83.55 21.48,83.55 18.43,80.5 7.69,80.5 MOT-Z2.4
  pour Bottom (isolate 0.4, rank 5, no thermals): 4.2,77.3 4,77.5 4,79 4.5,79.5 5.5,79.5 7.5,81.5 18,81.5 21,84.5 29.5,84.5 31.5,82.5 31.5,79 34.5,76 34.5,73 31.5,70 30,70 29.5,70.5 29.5,71.5 32,74 32,75 29,78 29,81.5 28,82.5 22,82.5 19,79.5 8.5,79.5 6.3,77.3
B2_E1  (via drill 0.4)
  Top 0.3: IC6.19 91,67.75 v91.05,67.8
  Top 0.6: C61.1 86.77,78.88 MOT-E1.3
  Top 0.8: v91.05,67.8 91.12,67.88 v92,67.88
  Bottom 1.5: MOT-E1.3 86.77,81.78 88.45,80.1 88.45,70.47 88.75,70.17 88.75,70.1 90.18,68.68 90.98,67.88 | v91.05,67.8 90.98,67.88 | v92,67.88 90.98,67.88
  pour Bottom (isolate 0.4, rank 4, no thermals): 92,66.5 90.5,66.5 87.5,69.5 87.5,79.5 85.7,81.3 85.7,84 88,84 88,82 89.5,80.5 89.5,71 91.5,69 92.5,69 93,68.5 93,67.5
B2_E2  (via drill 0.4)
  Top 0.3: IC7.19 111,67.75 v111.05,67.8
  Top 0.6: C74.1 106.77,78.88 MOT-E2.3
  Top 0.8: v111.05,67.8 111.12,67.88 v112,67.88
  Bottom 1.5: MOT-E2.3 106.77,81.78 108.45,80.1 108.45,70.47 108.75,70.17 108.75,70.1 110.98,67.88 | v111.05,67.8 110.98,67.88 | v112,67.88 110.98,67.88
  pour Bottom (isolate 0.4, rank 4, no thermals): 112,66.5 110.5,66.5 107.5,69.5 107.5,79.5 105.7,81.3 105.7,84 108,84 108,82 109.5,80.5 109.5,71 111.5,69 112.5,69 113,68.5 113,67.5
B2_X  (via drill 0.4)
  Top 0.3: IC8.19 71,67.75 v71.05,67.8
  Top 0.6: C87.1 66.77,78.88 MOT-X.3
  Top 0.8: v71.05,67.8 71.12,67.88 v72,67.88
  Bottom 1.5: MOT-X.3 66.77,81.78 68.45,80.1 68.45,70.47 68.75,70.17 68.75,70.1 70.98,67.88 | v71.05,67.8 70.98,67.88 | v72,67.88 70.98,67.88
  pour Bottom (isolate 0.4, rank 4, no thermals): 72,66.5 70.5,66.5 67.5,69.5 67.5,79.5 65.7,81.3 65.7,84 68,84 68,82 69.5,80.5 69.5,71 71.5,69 72.5,69 73,68.5 73,67.5
B2_Y  (via drill 0.4)
  Top 0.3: IC9.19 51,67.75 v51.05,67.8
  Top 0.6: C100.1 46.77,78.88 MOT-Y.3
  Top 0.8: v51.05,67.8 51.12,67.88 v52,67.88
  Bottom 1.5: MOT-Y.3 46.77,81.78 48.45,80.1 48.45,70.47 48.75,70.17 48.75,70.1 v51.05,67.8 50.98,67.88 v52,67.88
  pour Bottom (isolate 0.4, rank 4, no thermals): 52,66.5 50.5,66.5 47.5,69.5 47.5,79.5 45.7,81.3 45.7,84 48,84 48,82 49.5,80.5 49.5,71 51.5,69 52.5,69 53,68.5 53,67.5
B2_Z  (via drill 0.4)
  Top 0.3: IC10.19 30.5,74.25 v30.55,74.3
  Top 0.6: C113.1 12.88,76.15 MOT-Z1.3
  Top 0.8: v30.55,74.3 30.62,74.38 v31.5,74.38
  Bottom 1.35: 24.63,81.85 24.74,81.85 24.8,81.92 27.73,81.92 27.8,81.85
  Bottom 1.5: 24.63,81.85 22.18,81.85 19.13,78.8 17.3,78.8 14.27,75.77 MOT-Z1.3 | v30.55,74.3 30.48,74.38 | 30.48,74.38 28.36,76.49 28.36,81.28 27.8,81.85 | v31.5,74.38 30.48,74.38
  pour Bottom (isolate 0.4, rank 4, no thermals): 32,75.5 32.5,75 32.5,74 31.5,73 30.5,73 30,73 27,76 27,78 27,80.5 22.5,80.5 19.5,77.5 18.5,77.5 17.5,77.5 15.5,75.5 14.7,74.7 14,74.7 10.8,74.7 10.5,75 10.5,76.5 11,77 11.5,77 14,77 15.5,78.5 16.5,79.5 17.5,79.5 18.5,79.5 21,82 21.5,82.5 24,82.5 28.5,82.5 29,82 29.5,81.5 29.5,77 31,75.5
B_Z
  Bottom 1.5: MOT-Z2.3 7.27,75.77 9.81,78.31 MOT-Z1.4
  pour Bottom (isolate 0.4, rank 6, no thermals): 4.3,74.7 3.5,75.5 3.5,76.5 4,77 7,77 9.5,79.5 14,79.5 14.5,79 14.5,78 13.5,77 10.5,77 8.2,74.7
BED  (via drill 0.4)
  Top 0.2: v77.5,7.7 77.5,6.3 72.99,1.79 50.85,1.79 v48.22,4.42 | IC3.86 74.35,21.23 74.63,21.23 75.3,20.56 75.3,20.37 77.83,17.83 v77.83,12.56 v77.84,12.55 | v39,5 36.45,5 R56.1
  Bottom 0.2: v77.84,12.55 77.84,8.04 v77.5,7.7 | v48.22,4.42 47.64,5 v39,5
BED_L
  Top 0.4: EXT2_L.A 13.7,32.05 R55.1
BED_OUT
  Top 0.4: R56.2 34.98,4.77 BEDOUT.1
BOOT
  Top 0.3: IC1.11 6.17,46.83 C7.1
BRA_E1
  Top 0.3: IC6.44 80.01,66.75
  Top 0.8: R58.1 78.63,66.75 80.01,66.75
BRA_E2
  Top 0.3: IC7.44 100.01,66.75
  Top 0.8: R62.1 98.63,66.75 100.01,66.75
BRA_X
  Top 0.3: IC8.44 60.01,66.75
  Top 0.8: R66.1 58.63,66.75 60.01,66.75
BRA_Y
  Top 0.3: IC9.44 40.01,66.75
  Top 0.8: R70.1 38.63,66.75 40.01,66.75
BRA_Z
  Top 0.3: IC10.44 19.51,73.25
  Top 0.8: R74.1 18.13,73.25 19.51,73.25
BRB_E1
  Top 0.3: IC6.17 90.99,66.75
  Top 0.8: R59.1 92.37,66.75 90.99,66.75
BRB_E2
  Top 0.3: IC7.17 110.99,66.75
  Top 0.8: R63.1 112.37,66.75 110.99,66.75
BRB_X
  Top 0.3: IC8.17 70.99,66.75
  Top 0.8: R67.1 72.37,66.75 70.99,66.75
BRB_Y
  Top 0.3: IC9.17 50.99,66.75
  Top 0.8: R71.1 52.37,66.75 50.99,66.75
BRB_Z
  Top 0.3: IC10.17 30.49,73.25
  Top 0.8: R75.1 31.87,73.25 30.49,73.25
CLK
  Top 0.2: J1.P5 109.64,29.65 110.75,28.55 110.75,25.79 108.46,23.5 101.7,23.5 101.6,23.4 99.4,23.4 98.1,24.7 R30.2
CMD
  Top 0.2: J1.P3 109.64,31.85 111.65,29.84 111.65,25.42 108.83,22.6 102.07,22.6 101.97,22.5 101.5,22.5 | 101.5,22.5 100.25,22.5 R29.2 98.95,21.4 R35.1 | 101.5,22.5
CPI_E1
  Top 0.3: IC6.37 80.4,71.15 C54.1
CPI_E2
  Top 0.3: IC7.37 100.4,71.15 C67.1
CPI_X
  Top 0.3: IC8.37 60.4,71.15 C80.1
CPI_Y
  Top 0.3: IC9.37 40.4,71.15 C93.1
CPI_Z
  Top 0.3: IC10.37 19.9,77.65 C106.1
CPO_E1
  Top 0.3: C54.2 81.68,72.83 83.07,72.83 83.25,72.64 IC6.35
CPO_E2
  Top 0.3: C67.2 101.68,72.83 103.07,72.83 103.25,72.64 IC7.35
CPO_X
  Top 0.3: C80.2 61.68,72.83 63.07,72.83 63.25,72.64 IC8.35
CPO_Y
  Top 0.3: C93.2 41.68,72.83 43.07,72.83 43.25,72.64 IC9.35
CPO_Z
  Top 0.3: C106.2 21.18,79.33 22.57,79.33 22.75,79.14 IC10.35
DAT0
  Top 0.2: J1.P7 109.64,27.45 110.35,26.75 110.35,25.95 108.3,23.9 101.53,23.9 101.43,23.8 99.57,23.8 98.8,24.57 98.8,25.39 98.59,25.6 96.7,25.6 95.65,26.66 R28.2
DAT1
  Top 0.2: J1.P8 109.5,25.77 108.03,24.3 101.36,24.3 101.27,24.2 99.73,24.2 99.2,24.73 99.2,25.56 98.76,26 97.85,26 R32.2
DAT2
  Top 0.2: J1.P1 109.64,34.05 112.45,31.25 112.45,25.09 109.17,21.8 103.83,21.8 102.43,20.4 101.96,20.4 100.86,19.3 R33.2
DAT3
  Top 0.2: J1.P2 109.64,32.95 112.05,30.55 112.05,25.25 109,22.2 103.67,22.2 102.27,20.8 102.07,20.8 102,20.8 101.8,20.8 101.5,20.5 97.75,20.5 R31.2
DET
  Top 0.4: R27.2 106.17,37.17 106.42,37.42 106.8,37.05 | 106.8,37.05 106.82,37.03 J1.P9 | R34.1 106.8,37.05
E1_DIR  (via drill 0.4)
  Top 0.2: IC6.9 86.75,60.95 88.25,59.45 88.25,55.69 90.45,53.48 v90.45,27.38 | v54.91,25.7 55.32,26.11 56.62,26.11 IC3.51
  Bottom 0.2: v54.91,25.7 55.27,26.05 88.77,26.05 90.09,27.38 v90.45,27.38
E1_EN  (via drill 0.4)
  Top 0.2: IC6.3 83.75,60.45 82.17,58.87 v82.17,51.59 | v57.07,24.15 57.5,24.15 IC3.55 | v89.72,25.38 89.3,25.81 89.3,44.67 v88.72,45.25
  Bottom 0.2: v57.07,24.15 58.17,25.25 89.6,25.25 v89.72,25.38 | v88.72,45.25 88.51,45.25 v82.17,51.59
E1_FUSED
  Top 0.4: R54.2 15.65,19 F2.2
  Bottom 2: J2.2 15,21.46 F2.2
E1_STEP  (via drill 0.4)
  Top 0.2: IC6.8 86.25,60.88 87.85,59.28 87.85,55.52 89.7,53.67 89.7,26.83 v90.15,26.38 | v56.06,24.15 56.31,24.41 56.31,24.46 56.76,24.91 57.54,24.91 IC3.54
  Bottom 0.2: v56.06,24.15 56.31,24.41 56.31,24.46 57.5,25.65 88.93,25.65 89.65,26.38 v90.15,26.38
E2_DIR  (via drill 0.4)
  Top 0.2: v59,19.35 59,20.71 IC3.62 | v91.67,19.35 91.67,19.41 92.06,19.8 92.06,46.4 99.18,53.53 99.18,54.73 106.75,62.3 IC7.9
  Bottom 0.2: v59,19.35 59.35,19.7 91.31,19.7 v91.67,19.35
E2_EN  (via drill 0.4)
  Top 0.2: IC3.66 62.42,21.3 62.03,21.3 61,20.26 v61,18.08 | v89.65,18.55 89.65,19.01 91.26,20.61 91.26,49.94 103.75,62.43 IC7.3
  Bottom 0.2: v61,18.08 61.81,18.9 89.3,18.9 v89.65,18.55
E2_FUSED
  Top 0.4: R55.2 15.65,29 F3.2
  Bottom 2: J2.4 14.84,31.62 F3.2
E2_STEP  (via drill 0.4)
  Top 0.2: IC3.65 62.11,21.7 61.87,21.7 60.6,20.42 60.6,18.75 60,18.15 v60,17.65 | v90.66,18.95 90.66,19.41 91.66,20.4 91.66,46.57 98.78,53.69 98.78,54.89 106.25,62.36 IC7.8
  Bottom 0.2: v60,17.65 60,18.15 61.15,19.3 90.31,19.3 v90.66,18.95
EDR_CONN
  Top 0.4: R25.2 95.75,4.19 96.76,5.2 103.54,5.2 106.5,2.24 ESP8266.12
ENN  (via drill 0.4)
  Top 0.2: IC10.29 25.75,79.07 26.36,79.67 28.93,79.67 29.35,80.09 29.97,80.09 31.01,79.06 33.13,79.06 33.95,78.23 33.95,54.89 v34.5,54.35 | IC9.29 46.25,72.57 46.85,73.17 47.39,73.17 47.81,73.59 50.47,73.59 54.45,69.61 54.45,62.62 58.6,58.48 v58.6,54.35 | IC7.29 106.25,72.57 106.86,73.17 107.39,73.17 107.81,73.59 110.47,73.59 114.45,69.61 114.45,59.82 v108.97,54.34 | IC6.29 86.25,72.57 86.86,73.17 87.39,73.17 87.81,73.59 90.47,73.59 94.45,69.61 94.45,54.39 v94.5,54.35 | IC8.29 66.25,72.57 66.86,73.17 67.39,73.17 67.81,73.59 70.47,73.59 74.45,69.61 74.45,54.39 v74.5,54.35 74.5,50.72 v73.91,50.13 | IC3.25 69.75,39.23 v69.75,46.12
  Bottom 0.2: v34.5,54.35 34.85,54.7 58.24,54.7 v58.6,54.35 58.95,54.7 74.15,54.7 v74.5,54.35 74.85,54.7 94.15,54.7 v94.5,54.35 94.85,54.7 108.61,54.7 v108.97,54.34 | v69.75,46.12 73.76,50.13 v73.91,50.13
ERASE  (via drill 0.4)
  Top 0.2: 78.67,13 78.67,17.56 75.7,20.54 75.7,20.73 74.79,21.63 74.66,21.63 IC3.87 | 78.67,13 v78.67,11.95 | 78.67,13
  Bottom 0.2: ERASE.2 80.88,11.95 v78.67,11.95
ESP_CS
  Top 0.4: R26.2 100.49,4.25 102.5,2.24 ESP8266.10
ESP_DATA_RDY  (via drill 0.4)
  Top 0.2: R25.1 91.15,6.8 v91,6.8 | IC3.73 65.15,19.08 65.15,17.32 63,15.17 v63,11.82
  Bottom 0.2: v91,6.8 | v91,6.8 84.11,13.7 70.92,13.7 69.87,12.65 63.83,12.65 v63,11.82
ESP_EN  (via drill 0.4)
  Top 0.2: ESP8266.3 110.5,17.09 109.25,18.35 105.66,18.35 104.55,19.45 R17.1 104.55,20.15 v105.1,20.7 | IC3.71 64.35,19.69 64.35,17.66 60.73,14.04 v60.73,13.38
  Bottom 0.2: v60.73,13.38 61.23,13.38 62.5,14.65 69.04,14.65 70.09,15.7 87.47,15.7 89.08,14.1 93.5,14.1 94.68,15.28 99.67,15.28 v105.1,20.7
ESP_MISO  (via drill 0.4)
  Top 0.2: IC3.41 58.86,36.05 55.77,36.05 55.49,36.34 53.5,36.34 52.35,35.19 52.35,33.4 51.35,32.4 51.35,19.68 55,16.03 v55,15.26 | R20.2 93.2,12.3 v90.66,9.76
  Bottom 0.2: v90.66,9.76 86.31,14.1 70.75,14.1 69.7,13.05 63.16,13.05 61.54,11.43 59.92,11.43 59.47,11.89 57.09,11.89 55,13.97 v55,15.26
ESP_MOSI  (via drill 0.4)
  Top 0.2: R21.2 95.1,14.4 v95,14.5 | v114,26.84 113.65,27.19 113.65,33.98 110.12,37.51 110.12,41.59 v109.48,42.23 | v61.74,44.33 61.15,43.74 61.15,39.07 61.61,38.61 61.62,38.61 62.36,37.86 62.71,37.86 IC3.33
  Bottom 0.2: v95,14.5 101.13,14.5 113.47,26.84 v114,26.84 | v109.48,42.23 109.48,42.73 107.71,44.5 88.39,44.5 87.51,45.37 62.78,45.37 v61.74,44.33
ESP_NPCS0  (via drill 0.4)
  Top 0.2: IC3.42 58.56,35.65 55.61,35.65 55.32,35.94 53.66,35.94 52.75,35.03 52.75,33.23 51.75,32.23 51.75,19.85 53.5,18.1 v54.29,18.1 | v92.48,4.41 93.2,3.69 93.2,3.21 93.86,2.55 R26.1
  Bottom 0.2: v54.29,18.1 54.29,17.03 55.76,15.57 55.76,13.78 57.25,12.29 59.63,12.29 60.09,11.83 61.38,11.83 63,13.45 69.54,13.45 70.59,14.5 86.98,14.5 91.85,9.62 91.85,5.03 v92.48,4.41
ESP_RESET  (via drill 0.4)
  Top 0.2: v107.97,43.17 108.72,42.41 108.72,41.92 109.72,40.92 109.72,37.35 113.25,33.82 113.25,26.53 113.96,25.82 113.96,25.2 113.52,24.76 112.69,24.76 108.88,20.95 R18.1 | v62.81,44.33 61.55,43.07 61.55,39.24 62.53,38.26 63.01,38.26 IC3.32
  Bottom 0.2: v107.97,43.17 107.97,43.2 107.07,44.1 88.22,44.1 87.34,44.97 63.53,44.97 62.89,44.33 v62.81,44.33
ESP_RST
  Top 0.2: 106.3,19.3 R18.2
  Top 0.3: ESP8266.1 114.5,17.17 112.92,18.75 112.36,18.75 110.66,20.45 109,20.45 R22.2 107.84,19.3 106.3,19.3
ESP_RXD
  Top 0.4: R23.2 108.64,8.1 114.5,2.24 ESP8266.16
ESP_SCK  (via drill 0.4)
  Top 0.2: IC3.31 63.32,38.66 62.69,38.66 61.95,39.41 61.95,42.41 63.76,44.22 v63.85,44.22 | v113.2,25.51 112.85,25.86 112.85,33.65 109.32,37.18 109.32,40.75 v107.97,42.1 | v95,11.5 96.15,10.35 R19.2
  Bottom 0.2: v95,11.5 99.19,11.5 v113.2,25.51 | v107.97,42.1 106.38,43.7 88.05,43.7 87.45,44.3 63.93,44.3 v63.85,44.22
ESP_TXD
  Top 0.4: R24.2 108.74,6 112.5,2.24 ESP8266.15
ESP_URXD  (via drill 0.4)
  Top 0.2: v56.32,16.71 56.32,17.2 55.45,18.08 55.45,18.85 54.2,20.1 53.57,20.1 52.95,20.72 52.95,31.73 54.01,32.8 v54.35,32.8 | IC3.46 58.6,32.78 58.6,32.85 58.16,33.29 57.18,33.29 v57.06,33.18 | R23.1 95.25,9 v95,9
  Bottom 0.2: v56.32,16.71 56.58,16.44 56.58,14.09 57.58,13.09 59.97,13.09 60.42,12.63 61.05,12.63 62.67,14.25 69.2,14.25 70.25,15.3 87.31,15.3 93.61,9 v95,9 | v54.35,32.8 56.4,32.8 56.78,33.18 v57.06,33.18
ESP_UTXD  (via drill 0.4)
  Top 0.2: R24.1 94,6.05 v94,7.3 | IC3.44 57.94,34.85 55.28,34.85 54.99,35.14 53.99,35.14 53.55,34.7 53.55,32.9 52.55,31.9 52.55,20.55 53.4,19.7 54.03,19.7 55.05,18.68 55.05,17.41 v55.33,17.14
  Bottom 0.2: v94,7.3 94,8.04 87.14,14.9 70.42,14.9 69.37,13.85 62.83,13.85 61.21,12.23 60.26,12.23 59.8,12.69 57.42,12.69 56.16,13.95 56.16,15.73 55.33,16.56 v55.33,17.14
ESP_VIN
  Top 0.8: L6.2 99.7,16.2 ESP8266.8
EXT1  (via drill 0.4)
  Top 0.2: IC3.40 59.12,36.5 56.96,36.5 56.73,36.73 v56.66,36.8 | R52.1 24.71,34.85 v26.06,36.2
  Bottom 0.2: v26.06,36.2 27.48,37.62 40,37.62 40.81,36.8 v56.66,36.8
EXT1_D  (via drill 0.4)
  other vias: 11,16.5 11,18 11,15 13,17 13,16
  pour Top (rank 2, no thermals): 14.5,19.5 3.5,19.5 3.5,13.5 14.5,13.5
  pour Bottom (rank 2, no thermals): 14.5,19.5 3.5,19.5 3.5,13.5 14.5,13.5
EXT1_G  (via drill 0.4)
  Top 0.2: Q3.4 15.47,17.48 v15.8,17.8 | R52.2 24.5,32.59 v23.5,31.59
  Bottom 0.2: v15.8,17.8 17.1,16.5 18.5,16.5 19.5,17.5 19.5,29 22.09,31.59 v23.5,31.59
EXT2  (via drill 0.4)
  Top 0.2: IC3.19 72.18,37.42 72.18,37.5 72.85,38.18 v72.85,38.7 | R53.1 25.1,38.23 26.82,36.51 v26.82,31.65
  Bottom 0.2: v26.82,31.65 26.82,31.57 27.77,30.61 31.99,30.61 32.03,30.66 33.59,30.66 34.82,29.43 40.08,29.43 41.78,27.72 41.99,27.72 41.99,27.71 63.15,27.71 64.68,29.25 64.68,31.3 72.08,38.7 v72.85,38.7
EXT2_D  (via drill 0.4)
  other vias: 13,26 13,27 11,28 11,26.5 11,25
  pour Top (rank 2, no thermals): 14.5,29.5 14.5,23.5 3.5,23.5 3.5,29.5
  pour Bottom (rank 2, no thermals): 14.5,29.5 3.5,29.5 3.5,23.5 14.5,23.5
EXT2_G  (via drill 0.4)
  Top 0.2: Q4.4 15.47,27.48 v15.8,27.8 | R53.2 23.9,36.22 v23.5,35.82
  Bottom 0.2: v15.8,27.8 17.1,26.5 18,26.5 19,27.5 19,31.32 v23.5,35.82
EXT_L
  Top 0.4: EXT1_L.A 13.7,22.05 R54.1
FAN1_D
  Top 0.4: Q1.6 31.65,10.88 FAN1.2
FAN1_G
  Top 0.2: Q1.2 31.1,14.2 31.1,13.76 31.3,13.55 31.89,13.55 32.2,13.24 32.2,11.75 R48.2
FAN2_D
  Top 0.4: Q1.3 30.35,14.88 FAN2.2
FAN2_G
  Top 0.2: Q1.5 31,13.14 30.7,13.45 29.5,13.45 29.4,13.45 28.9,13.45 R49.2
FAN3_D
  Top 0.4: Q2.6 31.25,25.98 FAN3.2
FAN3_G
  Top 0.2: Q2.2 30.6,30.25 30.93,30.57 30.93,35.42 R50.2
FAN4_D
  Top 0.4: Q2.3 29.95,30.78 FAN4.2
FAN4_G
  Top 0.2: R51.2 28.6,29.2 28.85,28.95 30.3,28.95 30.6,28.64 Q2.5
FAN_1  (via drill 0.4, 0.4 pad 0.55)
  Top 0.2: IC3.76 69.12,18.98 67.28,18.98 66.61,18.31 66.61,17.08 64.55,15.03 64.55,10.38 v63.33,9.17 | R48.1 32.12,10.13 v32.12,10.15
  Bottom 0.2: v63.33,9.17 62.53,9.17 61.28,7.91 61.28,6.9 60.08,5.7 57.5,5.7 53,10.2 49.47,10.2 48.63,11.04 48.63,11.59 47.44,12.77 45.6,12.77 43.23,15.14 42.65,15.14 41.33,16.45 41.33,17.04 40.69,17.68 38.34,17.68 38.26,17.6 37.63,17.6 36.7,18.53 35.1,18.53 33.66,17.09 32.18,17.09 31.57,16.49 31.57,10.7 v32.12,10.15
FAN_2  (via drill 0.4)
  Top 0.2: v25.7,13.6 25.8,13.7 R49.1 | IC3.43 58.25,35.25 55.44,35.25 55.16,35.54 53.83,35.54 53.15,34.86 53.15,33.07 52.15,32.07 52.15,20.02 53.22,18.95 v53.72,18.95
  Bottom 0.2: v53.72,18.95 53.31,18.54 43.5,18.54 42.89,19.15 38.78,19.15 38.42,19.51 33.94,19.51 31.17,16.74 31.17,16.06 28.71,13.6 v25.7,13.6
FAN_3  (via drill 0.4)
  Top 0.2: v74.64,35.94 74.23,35.94 IC3.14 | v32.35,29.91 31.85,30.41 31.85,36.2 R50.1
  Bottom 0.2: v74.64,35.94 74.54,35.94 73.69,36.8 73.69,37.5 73.24,37.94 71.89,37.94 65.08,31.13 65.08,29.08 63.31,27.31 41.83,27.31 41.82,27.32 40.16,27.32 39.73,26.89 35.37,26.89 v32.35,29.91
FAN_4  (via drill 0.4)
  Top 0.2: IC3.74 65.55,18.77 65.55,17.16 63.75,15.36 63.75,11.25 62.5,10 62.42,9.92 60.31,9.92 v60,10.23 | v37.95,18.35 37.15,19.15 34.95,19.15 34.75,19.36 34.75,19.59 34.45,19.9 32.95,19.9 32.45,20.41 32.45,24.88 v32.33,25 | v25.7,29.05 25.85,29.2 R51.1
  Bottom 0.2: v37.95,18.35 | v37.95,18.35 42.56,18.35 47.98,12.94 52.4,12.94 55.1,10.23 v60,10.23 | v25.7,29.05 27.98,29.05 28,29.08 28.53,29.08 32.33,25.29 v32.33,25
FB
  Top 0.3: R7.2 13.15,45.98 10.19,43.02 IC1.5
  Top 0.5: C10.2 R6.1 13.15,49.5 R7.2
GND  (via drill 0.4, 0.4 pad 0.55, 0.5)
  Top 0.2: C36.2 80.78,20.91 X1.2 80.12,20.91 C37.2 | v46,59 45.56,58.56 45.5,58.56 | v46,58 45.5,58.5 45.5,58.56 | v45,58 45,58.06 45.5,58.56 | v45,59 45.06,59 45.5,58.56 | v66,59 65.5,58.5 | 65.5,58.5 v66,58 | 65.5,58.5 v65,58 | 65.5,58.5 v65,59 | v85,58.5 85.5,59 | v86,58.5 85.5,59 | v86,59.5 85.5,59 | v85,59.5 85.5,59 | v106,59 105.5,58.5 | v105,59 105.5,58.5 | v105,58 105.5,58.5 | v106,58 105.5,58.5 | v20.5,42 20,41.5 | v19.5,42 20,41.5 | v20.5,41 20,41.5 | v19.5,41 20,41.5 | v31,21.5 30.5,21 | v31,20.5 30.5,21 | v30,20.5 30.5,21 | v30,21.5 30.5,21 | 65.5,43 v66,42.5 | v65,42.5 65.5,43 | v66,43.5 65.5,43 | v65,43.5 65.5,43 | RESET.B RESET.B' 46.1,26.1 v45.5,25.5 | IC5.2 57.05,7.7 57.25,7.5 | IC4.10 35.5,17.48 v35.75,17.73